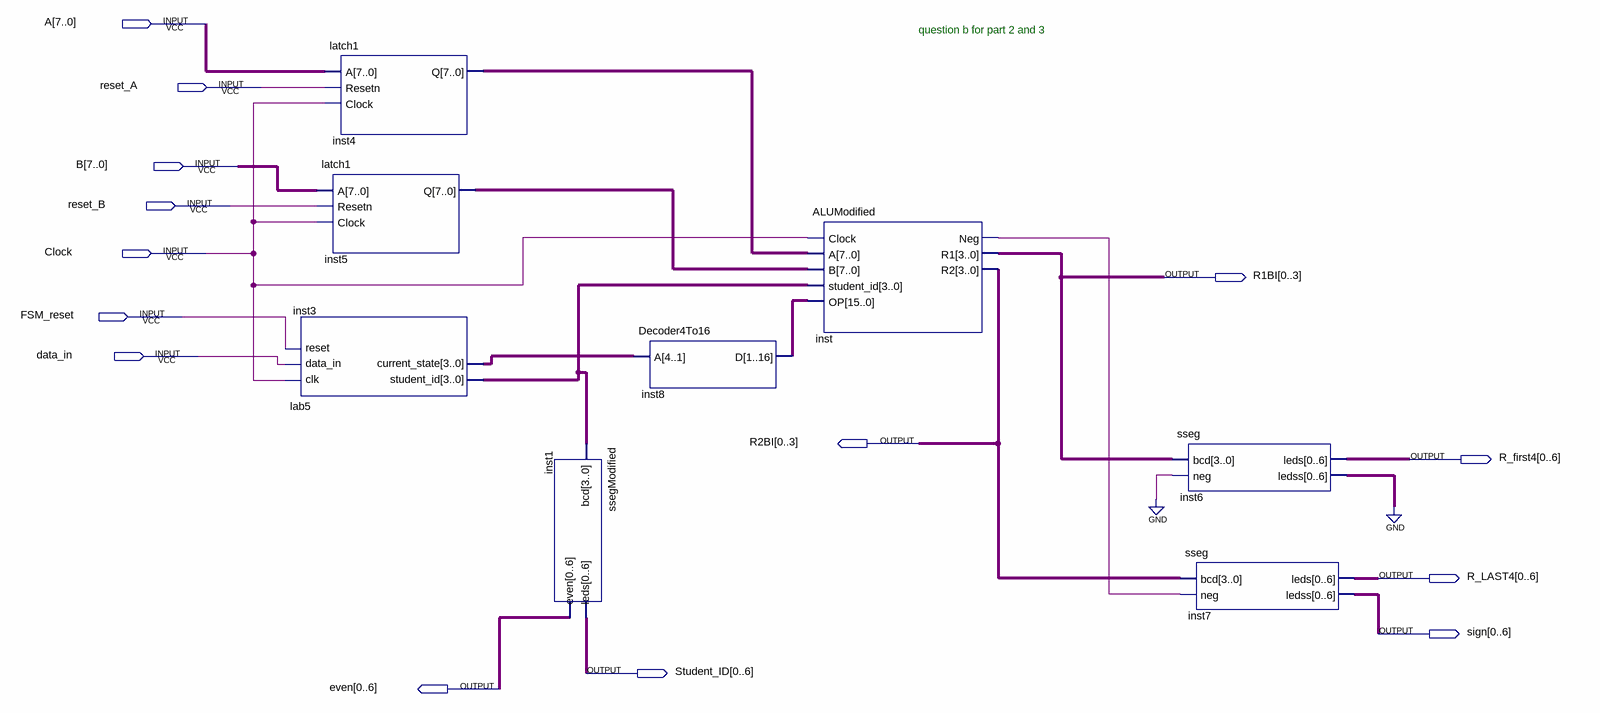
[diagram p0: schematic sheet]
// Quartus schematic CiruitProblem3.bdf as structural Verilog: 8 symbols, 14 pins
module CiruitProblem3 (
  input  [7:0] A,
  input  reset_A,
  input  [7:0] B,
  input  reset_B,
  input  Clock,
  input  FSM_reset,
  input  data_in,
  output [0:3] R1BI,
  output [0:3] R2BI,
  output [0:6] R_first4,
  output [0:6] R_LAST4,
  output [0:6] sign,
  output [0:6] Student_ID,
  output [0:6] even
);

  wire inst_neg;
  wire [3:0] inst3_current_state, inst3_student_id;
  wire [6:0] inst6_ledss;
  wire [7:0] inst4_q, inst5_q;
  wire [15:0] inst8_d;

  lab5 inst3 (
    .clk(Clock), .data_in(data_in), .reset(FSM_reset), .student_id(inst3_student_id),
    .current_state(inst3_current_state));
  latch1 inst4 (.A(A), .Resetn(reset_A), .Clock(Clock), .Q(inst4_q));
  latch1 inst5 (.A(B), .Resetn(reset_B), .Clock(Clock), .Q(inst5_q));
  ssegModified inst1 (.bcd(inst3_student_id), .leds(Student_ID), .even(even));
  Decoder4To16 inst8 (.A(inst3_current_state), .D(inst8_d));
  ALUModified inst (
    .Clock(Clock), .A(inst4_q), .B(inst5_q), .student_id(inst3_student_id), .OP(inst8_d), .Neg(inst_neg),
    .R1(R1BI), .R2(R2BI));
  sseg inst6 (.bcd(R1BI), .neg(1'b0), .leds(R_first4), .ledss(inst6_ledss));
  sseg inst7 (.bcd(R2BI), .neg(inst_neg), .leds(R_LAST4), .ledss(sign));
  // also tied to GND on the sheet: {inst6_ledss[0], inst6_ledss[1], inst6_ledss[2], inst6_ledss[3], inst6_ledss[4], inst6_ledss[5], inst6_ledss[6]}

  // Notes on the sheet:
  //   question b for part 2 and 3
endmodule
